# EAGLE schematic X8-Backplane (EAGLE 7.5.0)
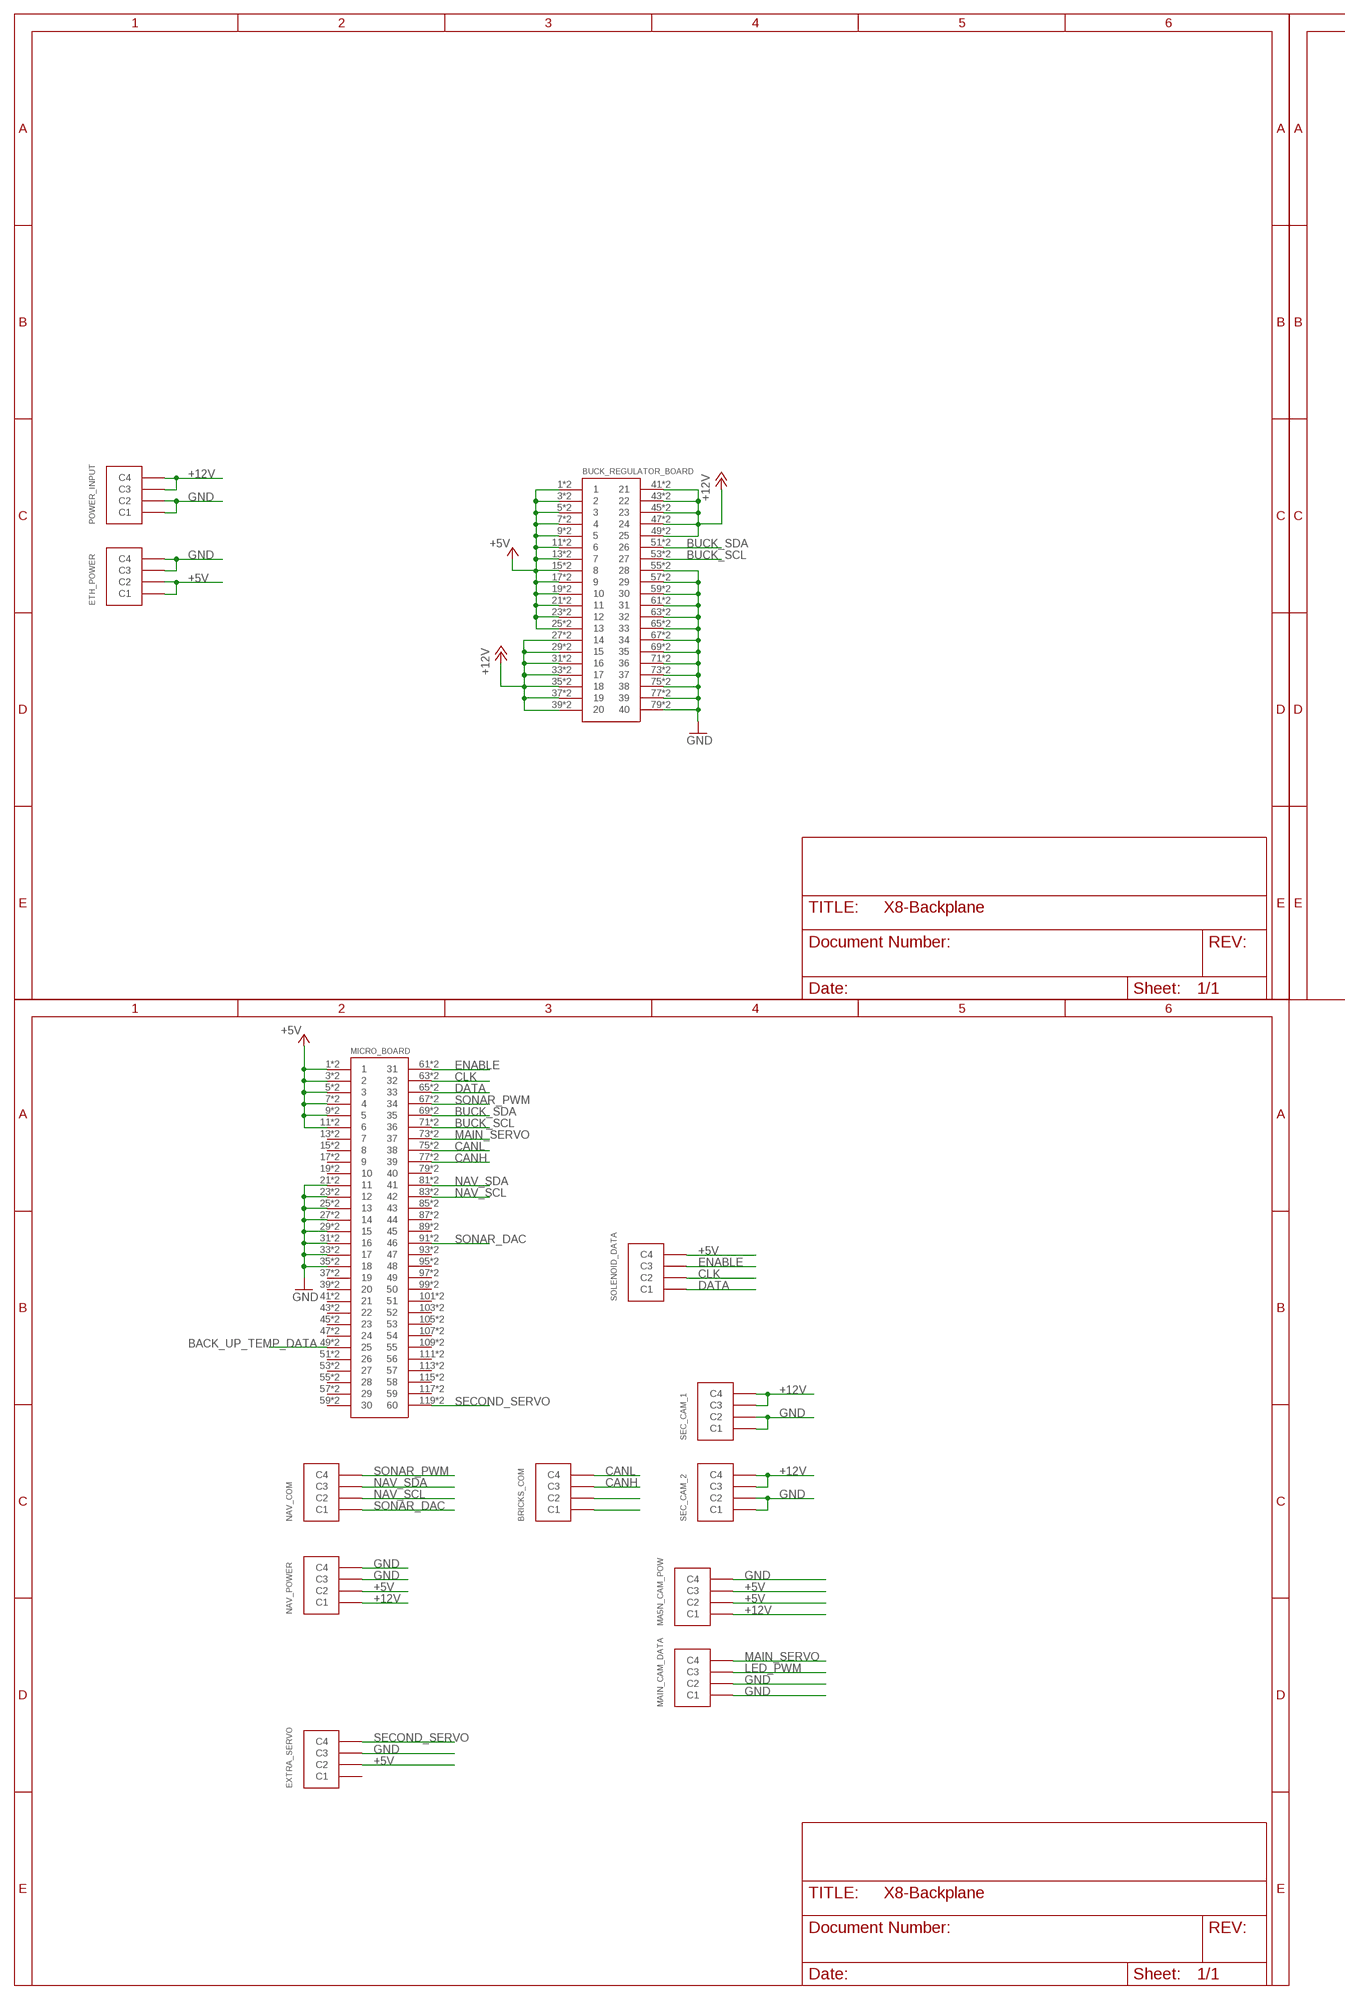
[diagram p0: schematic, sheet 1, part 1 of 2]
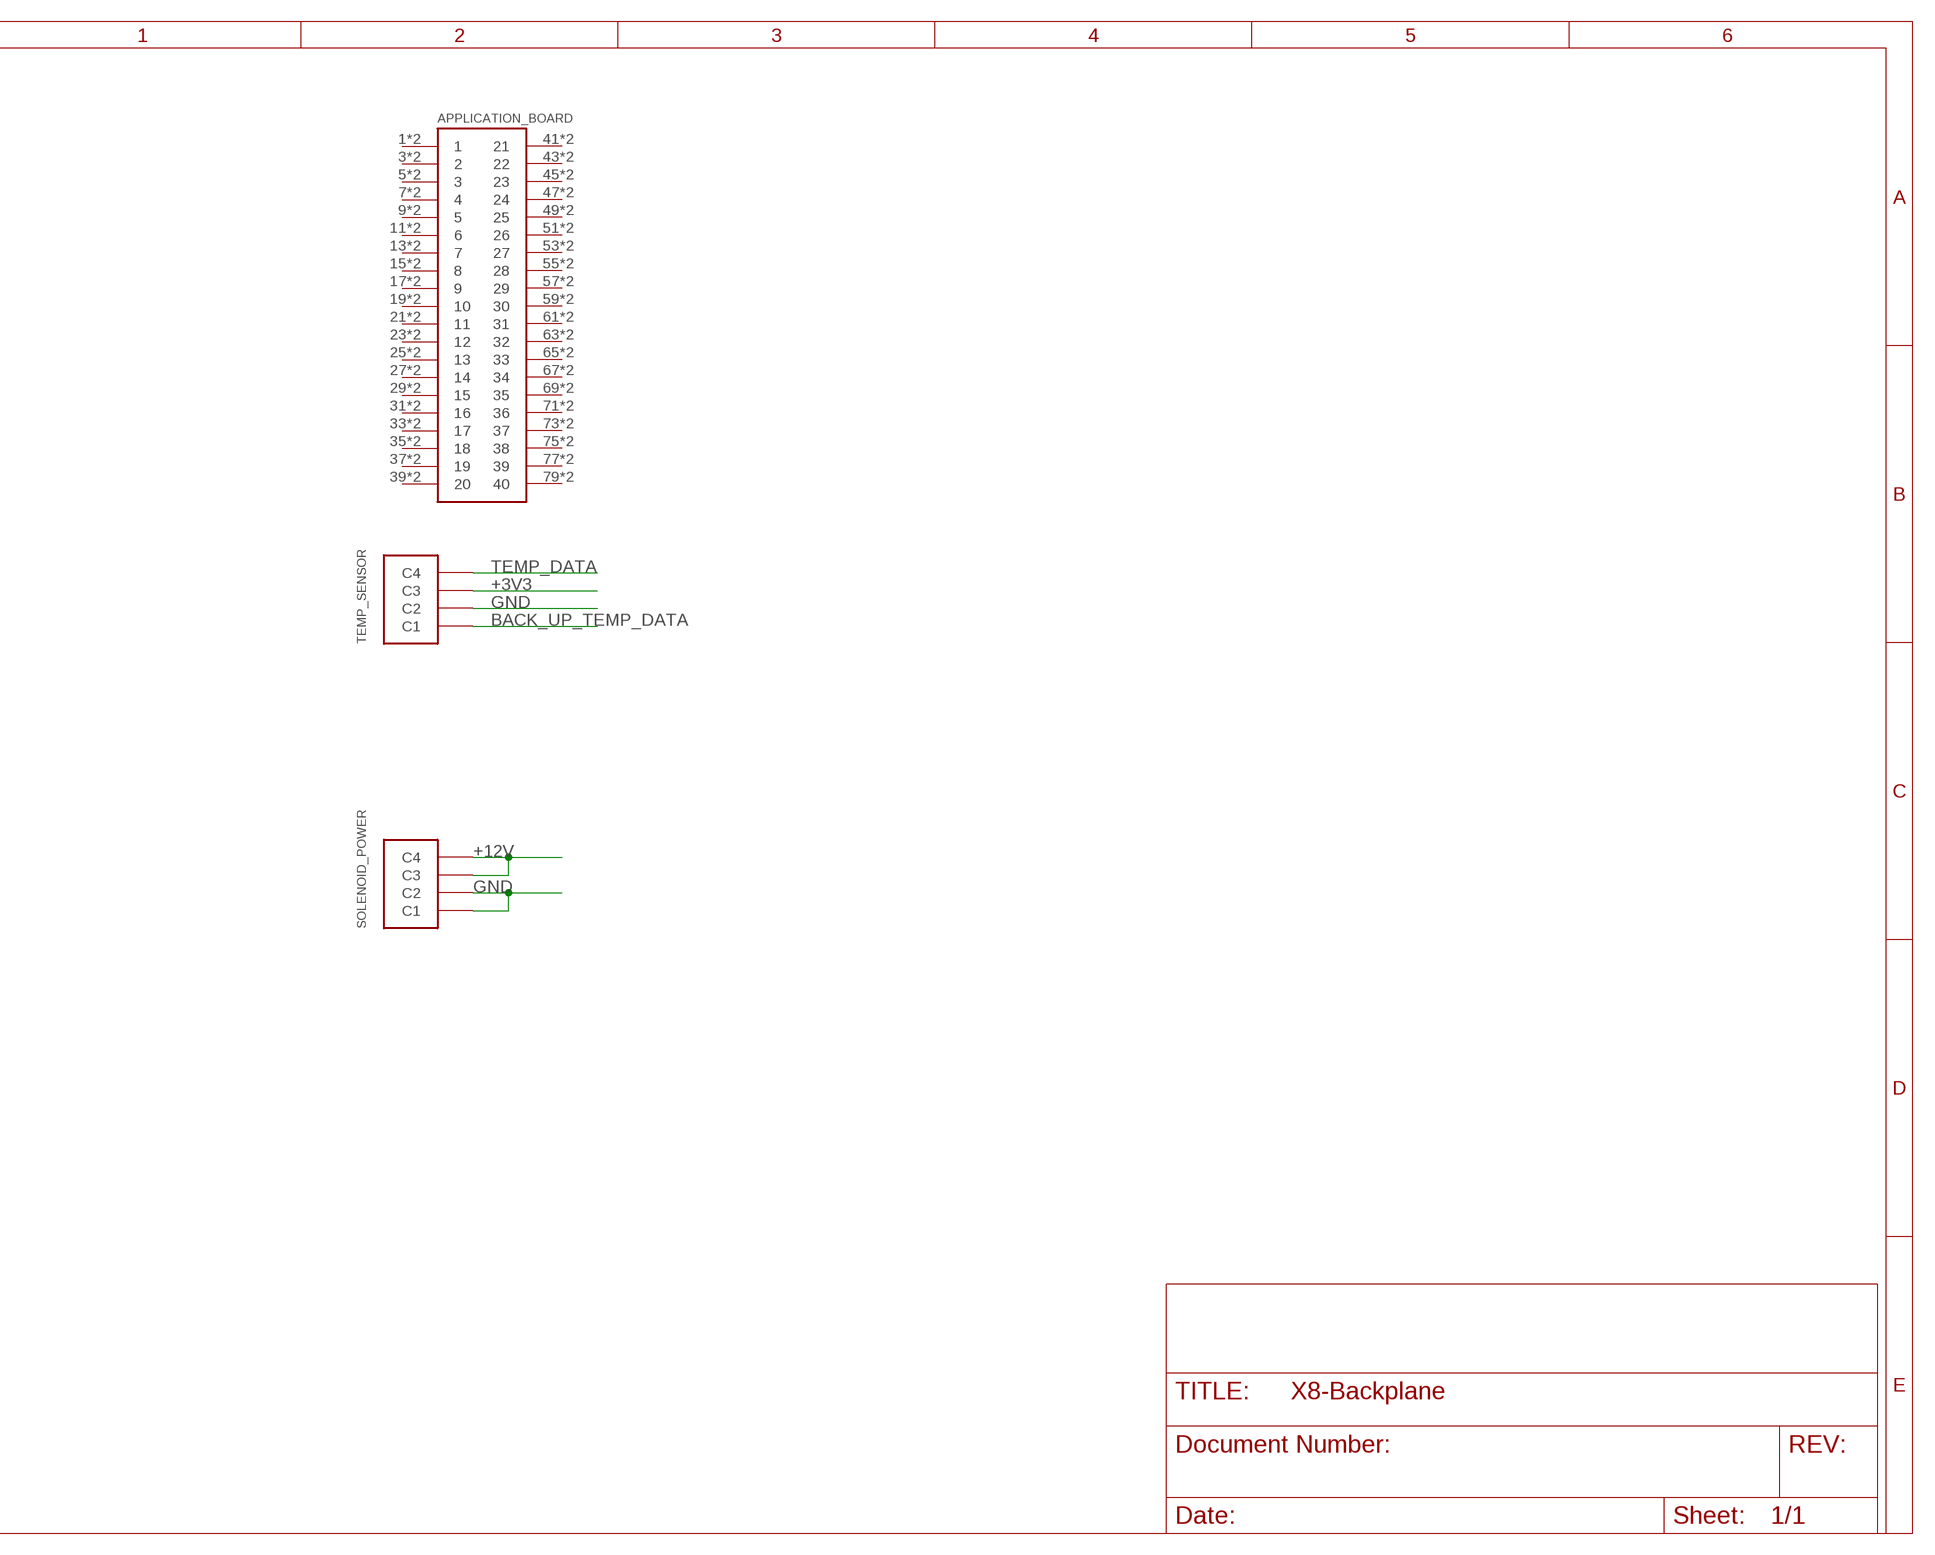
[diagram p1: schematic, sheet 1, part 2 of 2]

## Parts
APPLICATION_BOARD  HSEC8-140-01-XX-DV-A  [HSEC8-140-01-XX-DV-A]
BRICKS_COM  MICRO-FIT-4-SMD-PART  [MICRO-FIT-4-SMD]
BUCK_REGULATOR_BOARD  HSEC8-140-01-XX-DV-A  [HSEC8-140-01-XX-DV-A]
ETH_POWER  MICRO-FIT-4-SMD-PART  [MICRO-FIT-4-SMD]
EXTRA_SERVO  MICRO-FIT-4-SMD-PART  [MICRO-FIT-4-SMD]
MA5N_CAM_POW  MICRO-FIT-4-SMD-PART  [MICRO-FIT-4-SMD]
MAIN_CAM_DATA  MICRO-FIT-4-SMD-PART  [MICRO-FIT-4-SMD]
MICRO_BOARD  HSEC8-160-01-XX-DV-A  [HSEC8-160-01-XX-DV-A]
NAV_COM  MICRO-FIT-4-SMD-PART  [MICRO-FIT-4-SMD]
NAV_POWER  MICRO-FIT-4-SMD-PART  [MICRO-FIT-4-SMD]
POWER_INPUT  MICRO-FIT-4-SMD-PART  [MICRO-FIT-4-SMD]
SEC_CAM_1  MICRO-FIT-4-SMD-PART  [MICRO-FIT-4-SMD]
SEC_CAM_2  MICRO-FIT-4-SMD-PART  [MICRO-FIT-4-SMD]
SOLENOID_DATA  MICRO-FIT-4-SMD-PART  [MICRO-FIT-4-SMD]
SOLENOID_POWER  MICRO-FIT-4-SMD-PART  [MICRO-FIT-4-SMD]
TEMP_SENSOR  MICRO-FIT-4-SMD-PART  [MICRO-FIT-4-SMD]

## Nets
+3V3: TEMP_SENSOR.C3
+5V: BUCK_REGULATOR_BOARD.1 BUCK_REGULATOR_BOARD.2 BUCK_REGULATOR_BOARD.3 BUCK_REGULATOR_BOARD.4 BUCK_REGULATOR_BOARD.5 BUCK_REGULATOR_BOARD.6 BUCK_REGULATOR_BOARD.7 BUCK_REGULATOR_BOARD.8 BUCK_REGULATOR_BOARD.9 BUCK_REGULATOR_BOARD.10 BUCK_REGULATOR_BOARD.11 BUCK_REGULATOR_BOARD.12 BUCK_REGULATOR_BOARD.13 BUCK_REGULATOR_BOARD.14 BUCK_REGULATOR_BOARD.15 BUCK_REGULATOR_BOARD.16 BUCK_REGULATOR_BOARD.17 BUCK_REGULATOR_BOARD.18 BUCK_REGULATOR_BOARD.19 BUCK_REGULATOR_BOARD.20 BUCK_REGULATOR_BOARD.21 BUCK_REGULATOR_BOARD.22 BUCK_REGULATOR_BOARD.23 BUCK_REGULATOR_BOARD.24 BUCK_REGULATOR_BOARD.25 BUCK_REGULATOR_BOARD.26 ETH_POWER.C1 ETH_POWER.C2 EXTRA_SERVO.C2 MA5N_CAM_POW.C2 MA5N_CAM_POW.C3 MICRO_BOARD.1 MICRO_BOARD.2 MICRO_BOARD.3 MICRO_BOARD.4 MICRO_BOARD.5 MICRO_BOARD.6 MICRO_BOARD.7 MICRO_BOARD.8 MICRO_BOARD.9 MICRO_BOARD.10 MICRO_BOARD.11 MICRO_BOARD.12 NAV_POWER.C2 SOLENOID_DATA.C4
+12V: BUCK_REGULATOR_BOARD.27 BUCK_REGULATOR_BOARD.28 BUCK_REGULATOR_BOARD.29 BUCK_REGULATOR_BOARD.30 BUCK_REGULATOR_BOARD.31 BUCK_REGULATOR_BOARD.32 BUCK_REGULATOR_BOARD.33 BUCK_REGULATOR_BOARD.34 BUCK_REGULATOR_BOARD.35 BUCK_REGULATOR_BOARD.36 BUCK_REGULATOR_BOARD.37 BUCK_REGULATOR_BOARD.38 BUCK_REGULATOR_BOARD.39 BUCK_REGULATOR_BOARD.40 BUCK_REGULATOR_BOARD.41 BUCK_REGULATOR_BOARD.42 BUCK_REGULATOR_BOARD.43 BUCK_REGULATOR_BOARD.44 BUCK_REGULATOR_BOARD.45 BUCK_REGULATOR_BOARD.46 BUCK_REGULATOR_BOARD.47 BUCK_REGULATOR_BOARD.48 BUCK_REGULATOR_BOARD.49 BUCK_REGULATOR_BOARD.50 MA5N_CAM_POW.C1 NAV_POWER.C1 POWER_INPUT.C3 POWER_INPUT.C4 SEC_CAM_1.C3 SEC_CAM_1.C4 SEC_CAM_2.C3 SEC_CAM_2.C4 SOLENOID_POWER.C3 SOLENOID_POWER.C4
BACK_UP_TEMP_DATA: MICRO_BOARD.49 MICRO_BOARD.50 TEMP_SENSOR.C1
BUCK_SCL: BUCK_REGULATOR_BOARD.53 BUCK_REGULATOR_BOARD.54 MICRO_BOARD.71 MICRO_BOARD.72
BUCK_SDA: BUCK_REGULATOR_BOARD.51 BUCK_REGULATOR_BOARD.52 MICRO_BOARD.69 MICRO_BOARD.70
CANH: BRICKS_COM.C3 MICRO_BOARD.77 MICRO_BOARD.78
CANL: BRICKS_COM.C4 MICRO_BOARD.75 MICRO_BOARD.76
CLK: MICRO_BOARD.63 MICRO_BOARD.64 SOLENOID_DATA.C2
DATA: MICRO_BOARD.65 MICRO_BOARD.66 SOLENOID_DATA.C1
ENABLE: MICRO_BOARD.61 MICRO_BOARD.62 SOLENOID_DATA.C3
GND: BUCK_REGULATOR_BOARD.55 BUCK_REGULATOR_BOARD.56 BUCK_REGULATOR_BOARD.57 BUCK_REGULATOR_BOARD.58 BUCK_REGULATOR_BOARD.59 BUCK_REGULATOR_BOARD.60 BUCK_REGULATOR_BOARD.61 BUCK_REGULATOR_BOARD.62 BUCK_REGULATOR_BOARD.63 BUCK_REGULATOR_BOARD.64 BUCK_REGULATOR_BOARD.65 BUCK_REGULATOR_BOARD.66 BUCK_REGULATOR_BOARD.67 BUCK_REGULATOR_BOARD.68 BUCK_REGULATOR_BOARD.69 BUCK_REGULATOR_BOARD.70 BUCK_REGULATOR_BOARD.71 BUCK_REGULATOR_BOARD.72 BUCK_REGULATOR_BOARD.73 BUCK_REGULATOR_BOARD.74 BUCK_REGULATOR_BOARD.75 BUCK_REGULATOR_BOARD.76 BUCK_REGULATOR_BOARD.77 BUCK_REGULATOR_BOARD.78 BUCK_REGULATOR_BOARD.79 BUCK_REGULATOR_BOARD.80 ETH_POWER.C3 ETH_POWER.C4 EXTRA_SERVO.C3 MA5N_CAM_POW.C4 MAIN_CAM_DATA.C1 MAIN_CAM_DATA.C2 MICRO_BOARD.21 MICRO_BOARD.22 MICRO_BOARD.23 MICRO_BOARD.24 MICRO_BOARD.25 MICRO_BOARD.26 MICRO_BOARD.27 MICRO_BOARD.28 MICRO_BOARD.29 MICRO_BOARD.30 MICRO_BOARD.31 MICRO_BOARD.32 MICRO_BOARD.33 MICRO_BOARD.34 MICRO_BOARD.35 MICRO_BOARD.36 NAV_POWER.C3 NAV_POWER.C4 POWER_INPUT.C1 POWER_INPUT.C2 SEC_CAM_1.C1 SEC_CAM_1.C2 SEC_CAM_2.C1 SEC_CAM_2.C2 SOLENOID_POWER.C1 SOLENOID_POWER.C2 TEMP_SENSOR.C2
LED_PWM: MAIN_CAM_DATA.C3
MAIN_SERVO: MAIN_CAM_DATA.C4 MICRO_BOARD.73 MICRO_BOARD.74
N$3: BRICKS_COM.C2
N$5: BRICKS_COM.C1
NAV_SCL: MICRO_BOARD.83 MICRO_BOARD.84 NAV_COM.C2
NAV_SDA: MICRO_BOARD.81 MICRO_BOARD.82 NAV_COM.C3
SECOND_SERVO: EXTRA_SERVO.C4 MICRO_BOARD.119 MICRO_BOARD.120
SONAR_DAC: MICRO_BOARD.91 MICRO_BOARD.92 NAV_COM.C1
SONAR_PWM: MICRO_BOARD.67 MICRO_BOARD.68 NAV_COM.C4
TEMP_DATA: TEMP_SENSOR.C4
Unconnected: APPLICATION_BOARD.1 APPLICATION_BOARD.2 APPLICATION_BOARD.3 APPLICATION_BOARD.4 APPLICATION_BOARD.5 APPLICATION_BOARD.6 APPLICATION_BOARD.7 APPLICATION_BOARD.8 APPLICATION_BOARD.9 APPLICATION_BOARD.10 APPLICATION_BOARD.11 APPLICATION_BOARD.12 APPLICATION_BOARD.13 APPLICATION_BOARD.14 APPLICATION_BOARD.15 APPLICATION_BOARD.16 APPLICATION_BOARD.17 APPLICATION_BOARD.18 APPLICATION_BOARD.19 APPLICATION_BOARD.20 APPLICATION_BOARD.21 APPLICATION_BOARD.22 APPLICATION_BOARD.23 APPLICATION_BOARD.24 APPLICATION_BOARD.25 APPLICATION_BOARD.26 APPLICATION_BOARD.27 APPLICATION_BOARD.28 APPLICATION_BOARD.29 APPLICATION_BOARD.30 APPLICATION_BOARD.31 APPLICATION_BOARD.32 APPLICATION_BOARD.33 APPLICATION_BOARD.34 APPLICATION_BOARD.35 APPLICATION_BOARD.36 APPLICATION_BOARD.37 APPLICATION_BOARD.38 APPLICATION_BOARD.39 APPLICATION_BOARD.40 APPLICATION_BOARD.41 APPLICATION_BOARD.42 APPLICATION_BOARD.43 APPLICATION_BOARD.44 APPLICATION_BOARD.45 APPLICATION_BOARD.46 APPLICATION_BOARD.47 APPLICATION_BOARD.48 APPLICATION_BOARD.49 APPLICATION_BOARD.50 APPLICATION_BOARD.51 APPLICATION_BOARD.52 APPLICATION_BOARD.53 APPLICATION_BOARD.54 APPLICATION_BOARD.55 APPLICATION_BOARD.56 APPLICATION_BOARD.57 APPLICATION_BOARD.58 APPLICATION_BOARD.59 APPLICATION_BOARD.60 APPLICATION_BOARD.61 APPLICATION_BOARD.62 APPLICATION_BOARD.63 APPLICATION_BOARD.64 APPLICATION_BOARD.65 APPLICATION_BOARD.66 APPLICATION_BOARD.67 APPLICATION_BOARD.68 APPLICATION_BOARD.69 APPLICATION_BOARD.70 APPLICATION_BOARD.71 APPLICATION_BOARD.72 APPLICATION_BOARD.73 APPLICATION_BOARD.74 APPLICATION_BOARD.75 APPLICATION_BOARD.76 APPLICATION_BOARD.77 APPLICATION_BOARD.78 APPLICATION_BOARD.79 APPLICATION_BOARD.80 EXTRA_SERVO.C1 MICRO_BOARD.13 MICRO_BOARD.14 MICRO_BOARD.15 MICRO_BOARD.16 MICRO_BOARD.17 MICRO_BOARD.18 MICRO_BOARD.19 MICRO_BOARD.20 MICRO_BOARD.37 MICRO_BOARD.38 MICRO_BOARD.39 MICRO_BOARD.40 MICRO_BOARD.41 MICRO_BOARD.42 MICRO_BOARD.43 MICRO_BOARD.44 MICRO_BOARD.45 MICRO_BOARD.46 MICRO_BOARD.47 MICRO_BOARD.48 MICRO_BOARD.51 MICRO_BOARD.52 MICRO_BOARD.53 MICRO_BOARD.54 MICRO_BOARD.55 MICRO_BOARD.56 MICRO_BOARD.57 MICRO_BOARD.58 MICRO_BOARD.59 MICRO_BOARD.60 MICRO_BOARD.79 MICRO_BOARD.80 MICRO_BOARD.85 MICRO_BOARD.86 MICRO_BOARD.87 MICRO_BOARD.88 MICRO_BOARD.89 MICRO_BOARD.90 MICRO_BOARD.93 MICRO_BOARD.94 MICRO_BOARD.95 MICRO_BOARD.96 MICRO_BOARD.97 MICRO_BOARD.98 MICRO_BOARD.99 MICRO_BOARD.100 MICRO_BOARD.101 MICRO_BOARD.102 MICRO_BOARD.103 MICRO_BOARD.104 MICRO_BOARD.105 MICRO_BOARD.106 MICRO_BOARD.107 MICRO_BOARD.108 MICRO_BOARD.109 MICRO_BOARD.110 MICRO_BOARD.111 MICRO_BOARD.112 MICRO_BOARD.113 MICRO_BOARD.114 MICRO_BOARD.115 MICRO_BOARD.116 MICRO_BOARD.117 MICRO_BOARD.118

## Library data of the parts
APPLICATION_BOARD BUCK_REGULATOR_BOARD = HSEC8-1xx-01-XX-DV-A:HSEC8-140-01-XX-DV-A
BRICKS_COM ETH_POWER EXTRA_SERVO MA5N_CAM_POW MAIN_CAM_DATA NAV_COM NAV_POWER POWER_INPUT SEC_CAM_1 SEC_CAM_2 SOLENOID_DATA SOLENOID_POWER TEMP_SENSOR = Connectors:MICRO-FIT-4-SMD: 4 Pin Molex connector; DIGIKEY-CONTACT-PN: WM1125CT-ND; DIGIKEY-FEMALE-PN: WM2640CT-ND; DIGIKEY-MALE-PN: WM1847-ND
MICRO_BOARD = HSEC8-1xx-01-XX-DV-A:HSEC8-160-01-XX-DV-A